# EAGLE schematic athf-er-acrylic (EAGLE 6.3)
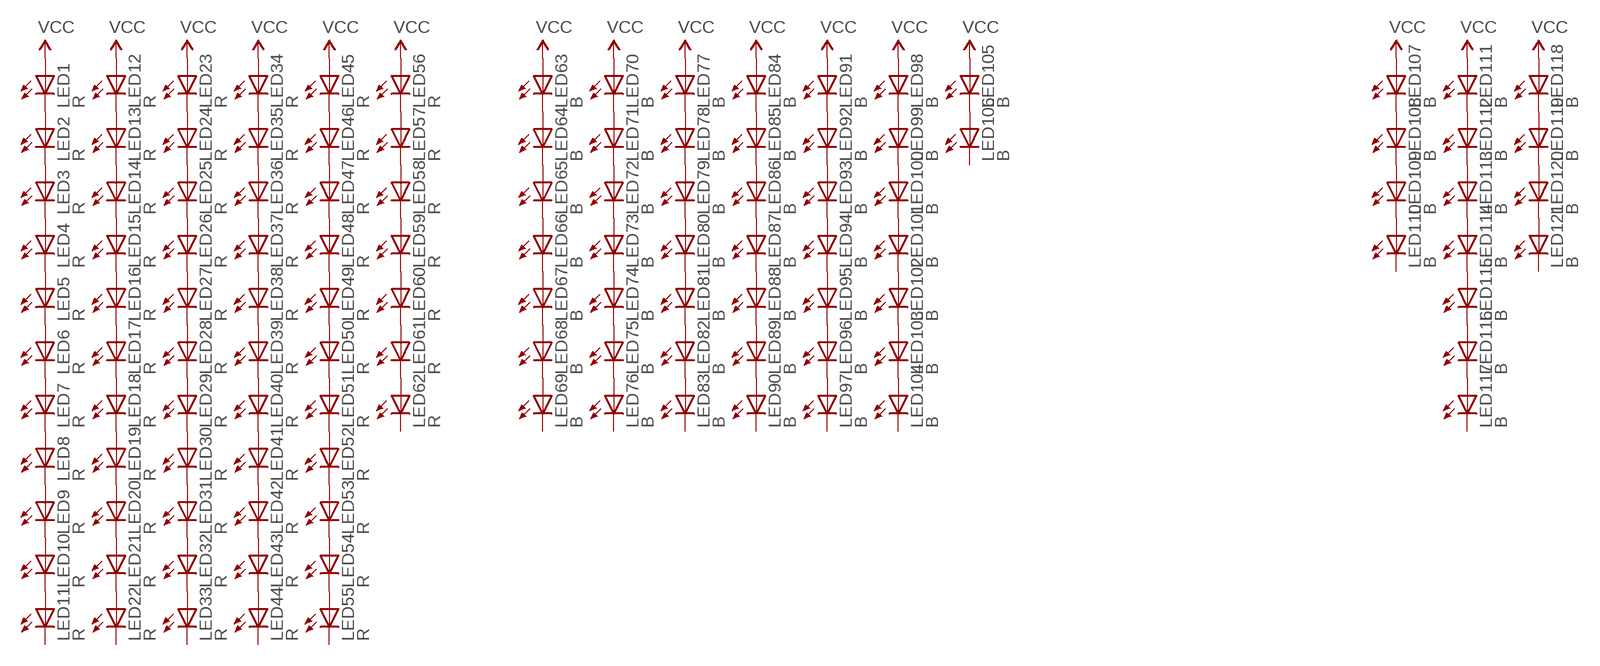
[diagram p0: schematic, sheet 1]

## Parts
LED1  R  LEDLED5MMSQUARE  [LED5MMSQUARE]
LED2  R  LEDLED5MMSQUARE  [LED5MMSQUARE]
LED3  R  LEDLED5MMSQUARE  [LED5MMSQUARE]
LED4  R  LEDLED5MMSQUARE  [LED5MMSQUARE]
LED5  R  LEDLED5MMSQUARE  [LED5MMSQUARE]
LED6  R  LEDLED5MMSQUARE  [LED5MMSQUARE]
LED7  R  LEDLED5MMSQUARE  [LED5MMSQUARE]
LED8  R  LEDLED5MMSQUARE  [LED5MMSQUARE]
LED9  R  LEDLED5MMSQUARE  [LED5MMSQUARE]
LED10  R  LEDLED5MMSQUARE  [LED5MMSQUARE]
LED11  R  LEDLED5MMSQUARE  [LED5MMSQUARE]
LED12  R  LEDLED5MMSQUARE  [LED5MMSQUARE]
LED13  R  LEDLED5MMSQUARE  [LED5MMSQUARE]
LED14  R  LEDLED5MMSQUARE  [LED5MMSQUARE]
LED15  R  LEDLED5MMSQUARE  [LED5MMSQUARE]
LED16  R  LEDLED5MMSQUARE  [LED5MMSQUARE]
LED17  R  LEDLED5MMSQUARE  [LED5MMSQUARE]
LED18  R  LEDLED5MMSQUARE  [LED5MMSQUARE]
LED19  R  LEDLED5MMSQUARE  [LED5MMSQUARE]
LED20  R  LEDLED5MMSQUARE  [LED5MMSQUARE]
LED21  R  LEDLED5MMSQUARE  [LED5MMSQUARE]
LED22  R  LEDLED5MMSQUARE  [LED5MMSQUARE]
LED23  R  LEDLED5MMSQUARE  [LED5MMSQUARE]
LED24  R  LEDLED5MMSQUARE  [LED5MMSQUARE]
LED25  R  LEDLED5MMSQUARE  [LED5MMSQUARE]
LED26  R  LEDLED5MMSQUARE  [LED5MMSQUARE]
LED27  R  LEDLED5MMSQUARE  [LED5MMSQUARE]
LED28  R  LEDLED5MMSQUARE  [LED5MMSQUARE]
LED29  R  LEDLED5MMSQUARE  [LED5MMSQUARE]
LED30  R  LEDLED5MMSQUARE  [LED5MMSQUARE]
LED31  R  LEDLED5MMSQUARE  [LED5MMSQUARE]
LED32  R  LEDLED5MMSQUARE  [LED5MMSQUARE]
LED33  R  LEDLED5MMSQUARE  [LED5MMSQUARE]
LED34  R  LEDLED5MMSQUARE  [LED5MMSQUARE]
LED35  R  LEDLED5MMSQUARE  [LED5MMSQUARE]
LED36  R  LEDLED5MMSQUARE  [LED5MMSQUARE]
LED37  R  LEDLED5MMSQUARE  [LED5MMSQUARE]
LED38  R  LEDLED5MMSQUARE  [LED5MMSQUARE]
LED39  R  LEDLED5MMSQUARE  [LED5MMSQUARE]
LED40  R  LEDLED5MMSQUARE  [LED5MMSQUARE]
LED41  R  LEDLED5MMSQUARE  [LED5MMSQUARE]
LED42  R  LEDLED5MMSQUARE  [LED5MMSQUARE]
LED43  R  LEDLED5MMSQUARE  [LED5MMSQUARE]
LED44  R  LEDLED5MMSQUARE  [LED5MMSQUARE]
LED45  R  LEDLED5MMSQUARE  [LED5MMSQUARE]
LED46  R  LEDLED5MMSQUARE  [LED5MMSQUARE]
LED47  R  LEDLED5MMSQUARE  [LED5MMSQUARE]
LED48  R  LEDLED5MMSQUARE  [LED5MMSQUARE]
LED49  R  LEDLED5MMSQUARE  [LED5MMSQUARE]
LED50  R  LEDLED5MMSQUARE  [LED5MMSQUARE]
LED51  R  LEDLED5MMSQUARE  [LED5MMSQUARE]
LED52  R  LEDLED5MMSQUARE  [LED5MMSQUARE]
LED53  R  LEDLED5MMSQUARE  [LED5MMSQUARE]
LED54  R  LEDLED5MMSQUARE  [LED5MMSQUARE]
LED55  R  LEDLED5MMSQUARE  [LED5MMSQUARE]
LED56  R  LEDLED5MMSQUARE  [LED5MMSQUARE]
LED57  R  LEDLED5MMSQUARE  [LED5MMSQUARE]
LED58  R  LEDLED5MMSQUARE  [LED5MMSQUARE]
LED59  R  LEDLED5MMSQUARE  [LED5MMSQUARE]
LED60  R  LEDLED5MMSQUARE  [LED5MMSQUARE]
LED61  R  LEDLED5MMSQUARE  [LED5MMSQUARE]
LED62  R  LEDLED5MMSQUARE  [LED5MMSQUARE]
LED63  B  LEDLED5MMSQUARE  [LED5MMSQUARE]
LED64  B  LEDLED5MMSQUARE  [LED5MMSQUARE]
LED65  B  LEDLED5MMSQUARE  [LED5MMSQUARE]
LED66  B  LEDLED5MMSQUARE  [LED5MMSQUARE]
LED67  B  LEDLED5MMSQUARE  [LED5MMSQUARE]
LED68  B  LEDLED5MMSQUARE  [LED5MMSQUARE]
LED69  B  LEDLED5MMSQUARE  [LED5MMSQUARE]
LED70  B  LEDLED5MMSQUARE  [LED5MMSQUARE]
LED71  B  LEDLED5MMSQUARE  [LED5MMSQUARE]
LED72  B  LEDLED5MMSQUARE  [LED5MMSQUARE]
LED73  B  LEDLED5MMSQUARE  [LED5MMSQUARE]
LED74  B  LEDLED5MMSQUARE  [LED5MMSQUARE]
LED75  B  LEDLED5MMSQUARE  [LED5MMSQUARE]
LED76  B  LEDLED5MMSQUARE  [LED5MMSQUARE]
LED77  B  LEDLED5MMSQUARE  [LED5MMSQUARE]
LED78  B  LEDLED5MMSQUARE  [LED5MMSQUARE]
LED79  B  LEDLED5MMSQUARE  [LED5MMSQUARE]
LED80  B  LEDLED5MMSQUARE  [LED5MMSQUARE]
LED81  B  LEDLED5MMSQUARE  [LED5MMSQUARE]
LED82  B  LEDLED5MMSQUARE  [LED5MMSQUARE]
LED83  B  LEDLED5MMSQUARE  [LED5MMSQUARE]
LED84  B  LEDLED5MMSQUARE  [LED5MMSQUARE]
LED85  B  LEDLED5MMSQUARE  [LED5MMSQUARE]
LED86  B  LEDLED5MMSQUARE  [LED5MMSQUARE]
LED87  B  LEDLED5MMSQUARE  [LED5MMSQUARE]
LED88  B  LEDLED5MMSQUARE  [LED5MMSQUARE]
LED89  B  LEDLED5MMSQUARE  [LED5MMSQUARE]
LED90  B  LEDLED5MMSQUARE  [LED5MMSQUARE]
LED91  B  LEDLED5MMSQUARE  [LED5MMSQUARE]
LED92  B  LEDLED5MMSQUARE  [LED5MMSQUARE]
LED93  B  LEDLED5MMSQUARE  [LED5MMSQUARE]
LED94  B  LEDLED5MMSQUARE  [LED5MMSQUARE]
LED95  B  LEDLED5MMSQUARE  [LED5MMSQUARE]
LED96  B  LEDLED5MMSQUARE  [LED5MMSQUARE]
LED97  B  LEDLED5MMSQUARE  [LED5MMSQUARE]
LED98  B  LEDLED5MMSQUARE  [LED5MMSQUARE]
LED99  B  LEDLED5MMSQUARE  [LED5MMSQUARE]
LED100  B  LEDLED5MMSQUARE  [LED5MMSQUARE]
LED101  B  LEDLED5MMSQUARE  [LED5MMSQUARE]
LED102  B  LEDLED5MMSQUARE  [LED5MMSQUARE]
LED103  B  LEDLED5MMSQUARE  [LED5MMSQUARE]
LED104  B  LEDLED5MMSQUARE  [LED5MMSQUARE]
LED105  B  LEDLED5MMSQUARE  [LED5MMSQUARE]
LED106  B  LEDLED5MMSQUARE  [LED5MMSQUARE]
LED107  B  LEDLED5MMSQUARE  [LED5MMSQUARE]
LED108  B  LEDLED5MMSQUARE  [LED5MMSQUARE]
LED109  B  LEDLED5MMSQUARE  [LED5MMSQUARE]
LED110  B  LEDLED5MMSQUARE  [LED5MMSQUARE]
LED111  B  LEDLED5MMSQUARE  [LED5MMSQUARE]
LED112  B  LEDLED5MMSQUARE  [LED5MMSQUARE]
LED113  B  LEDLED5MMSQUARE  [LED5MMSQUARE]
LED114  B  LEDLED5MMSQUARE  [LED5MMSQUARE]
LED115  B  LEDLED5MMSQUARE  [LED5MMSQUARE]
LED116  B  LEDLED5MMSQUARE  [LED5MMSQUARE]
LED117  B  LEDLED5MMSQUARE  [LED5MMSQUARE]
LED118  B  LEDLED5MMSQUARE  [LED5MMSQUARE]
LED119  B  LEDLED5MMSQUARE  [LED5MMSQUARE]
LED120  B  LEDLED5MMSQUARE  [LED5MMSQUARE]
LED121  B  LEDLED5MMSQUARE  [LED5MMSQUARE]

## Nets
N$1: LED7.K(C) LED8.A
N$2: LED6.K(C) LED7.A
N$3: LED13.K(C) LED14.A
N$5: LED111.K(C) LED112.A
N$6: LED18.K(C) LED19.A
N$7: LED107.K(C) LED108.A
N$8: LED105.K(C) LED106.A
N$9: LED14.K(C) LED15.A
N$10: LED15.K(C) LED16.A
N$11: LED30.K(C) LED31.A
N$13: LED16.K(C) LED17.A
N$14: LED36.K(C) LED37.A
N$15: LED2.K(C) LED3.A
N$16: LED3.K(C) LED4.A
N$17: LED108.K(C) LED109.A
N$18: LED48.K(C) LED49.A
N$19: LED4.K(C) LED5.A
N$20: LED1.K(C) LED2.A
N$21: LED109.K(C) LED110.A
N$22: LED63.K(C) LED64.A
N$23: LED60.K(C) LED61.A
N$24: LED64.K(C) LED65.A
N$25: LED65.K(C) LED66.A
N$26: LED66.K(C) LED67.A
N$27: LED112.K(C) LED113.A
N$28: LED67.K(C) LED68.A
N$29: LED68.K(C) LED69.A
N$30: LED17.K(C) LED18.A
N$31: LED42.K(C) LED43.A
N$33: LED54.K(C) LED55.A
N$35: LED70.K(C) LED71.A
N$36: LED71.K(C) LED72.A
N$37: LED72.K(C) LED73.A
N$38: LED118.K(C) LED119.A
N$39: LED119.K(C) LED120.A
N$40: LED73.K(C) LED74.A
N$41: LED74.K(C) LED75.A
N$42: LED5.K(C) LED6.A
N$43: LED8.K(C) LED9.A
N$44: LED9.K(C) LED10.A
N$45: LED10.K(C) LED11.A
N$46: LED12.K(C) LED13.A
N$47: LED19.K(C) LED20.A
N$48: LED20.K(C) LED21.A
N$49: LED21.K(C) LED22.A
N$50: LED24.K(C) LED25.A
N$51: LED23.K(C) LED24.A
N$52: LED25.K(C) LED26.A
N$53: LED26.K(C) LED27.A
N$54: LED27.K(C) LED28.A
N$55: LED28.K(C) LED29.A
N$56: LED29.K(C) LED30.A
N$57: LED31.K(C) LED32.A
N$58: LED32.K(C) LED33.A
N$60: LED34.K(C) LED35.A
N$61: LED35.K(C) LED36.A
N$62: LED37.K(C) LED38.A
N$63: LED38.K(C) LED39.A
N$64: LED39.K(C) LED40.A
N$65: LED40.K(C) LED41.A
N$66: LED41.K(C) LED42.A
N$67: LED43.K(C) LED44.A
N$69: LED45.K(C) LED46.A
N$70: LED46.K(C) LED47.A
N$71: LED47.K(C) LED48.A
N$72: LED49.K(C) LED50.A
N$73: LED50.K(C) LED51.A
N$74: LED51.K(C) LED52.A
N$75: LED52.K(C) LED53.A
N$76: LED53.K(C) LED54.A
N$78: LED56.K(C) LED57.A
N$79: LED57.K(C) LED58.A
N$80: LED58.K(C) LED59.A
N$81: LED59.K(C) LED60.A
N$82: LED61.K(C) LED62.A
N$83: LED75.K(C) LED76.A
N$85: LED77.K(C) LED78.A
N$86: LED78.K(C) LED79.A
N$87: LED79.K(C) LED80.A
N$88: LED80.K(C) LED81.A
N$89: LED81.K(C) LED82.A
N$90: LED82.K(C) LED83.A
N$92: LED84.K(C) LED85.A
N$93: LED85.K(C) LED86.A
N$94: LED86.K(C) LED87.A
N$95: LED87.K(C) LED88.A
N$96: LED88.K(C) LED89.A
N$97: LED89.K(C) LED90.A
N$98: LED91.K(C) LED92.A
N$99: LED92.K(C) LED93.A
N$100: LED93.K(C) LED94.A
N$101: LED94.K(C) LED95.A
N$102: LED95.K(C) LED96.A
N$103: LED96.K(C) LED97.A
N$104: LED98.K(C) LED99.A
N$105: LED99.K(C) LED100.A
N$106: LED100.K(C) LED101.A
N$107: LED101.K(C) LED102.A
N$108: LED102.K(C) LED103.A
N$109: LED103.K(C) LED104.A
N$110: LED113.K(C) LED114.A
N$111: LED114.K(C) LED115.A
N$112: LED115.K(C) LED116.A
N$113: LED116.K(C) LED117.A
N$114: LED120.K(C) LED121.A
VCC: LED1.A LED12.A LED23.A LED34.A LED45.A LED56.A LED63.A LED70.A LED77.A LED84.A LED91.A LED98.A LED105.A LED107.A LED111.A LED118.A
Unconnected: LED11.K(C) LED22.K(C) LED33.K(C) LED44.K(C) LED55.K(C) LED62.K(C) LED69.K(C) LED76.K(C) LED83.K(C) LED90.K(C) LED97.K(C) LED104.K(C) LED106.K(C) LED110.K(C) LED117.K(C) LED121.K(C)

## Library data of the parts
LED1-LED121 = led:LED: LED OSRAM: - CHIPLED LG R971, LG N971, LY N971, LG Q971, LY Q971, LO R971, LY R971 LH N974, LH R974 LS Q976, LO Q976, LY Q976 LO Q996 - Hyper CHIPLED LW Q18S LB Q993, LB Q99A, LB R99A - SideLED LS A670, LO A670, LY A670, LG A670, LP A670 LB A673, LV A673, LT A673, LW A673 LH A674 LY A675 LS A676, LA A676, LO A676, LY A676, LW A676 LS A679, LY A679, LG A679 - Hyper Micro SIDELED® LS Y876, LA Y876, LO Y876, LY Y876 LT Y87S - SmartLED LW L88C, LW L88S LB L89C, LB L89S, LG L890 LS L89K, LO L89K, LY L89K LS L896, LA L896, LO L896, LY L896 - TOPLED LS T670, LO T670, LY T670, LG T670, LP T670 LSG T670, LSP T670, LSY T670, LOP T670, LYG T670 LG T671, LOG T671, LSG T671 LB T673, LV T673, LT T673, LW T673 LH T674 LS T676, LA T676, LO T676, LY T676, LB T676, LH T676, LSB T676, LW T676 LB T67C, LV T67C, LT T67C, LS T67K, LO T67K, LY T67K, LW E67C LS E67B, LA E67B, LO E67B, LY E67B, LB E67C, LV E67C, LT E67C LW T67C LS T679, LY T679, LG T679 LS T770, LO T770, LY T770, LG T770, LP T770 LB T773, LV T773, LT T773, LW T773 LH T774 LS E675, LA E675, LY E675, LS T675 LS T776, LA T776, LO T776, LY T776, LB T776 LHGB T686 LT T68C, LB T68C - Hyper Mini TOPLED® LB M676 - Mini TOPLED Santana® LG M470 LS M47K, LO M47K, LY M47K Source: http://www.osram.convergy.de LUXEON: - LUMILED® LXK2-PW12-R00, LXK2-PW12-S00, LXK2-PW14-U00, LXK2-PW14-V00 LXK2-PM12-R00, LXK2-PM12-S00, LXK2-PM14-U00 LXK2-PE12-Q00, LXK2-PE12-R00, LXK2-PE12-S00, LXK2-PE14-T00, LXK2-PE14-U00 LXK2-PB12-K00, LXK2-PB12-L00, LXK2-PB12-M00, LXK2-PB14-N00, LXK2-PB14-P00, LXK2-PB14-Q00 LXK2-PR12-L00, LXK2-PR12-M00, LXK2-PR14-Q00, LXK2-PR14-R00 LXK2-PD12-Q00, LXK2-PD12-R00, LXK2-PD12-S00 LXK2-PH12-R00, LXK2-PH12-S00 LXK2-PL12-P00, LXK2-PL12-Q00, LXK2-PL12-R00 Source: www.luxeon.com KINGBRIGHT: KA-3528ASYC Source: www.kingbright.com